# Altium project WLED_Controller.PrjPcb
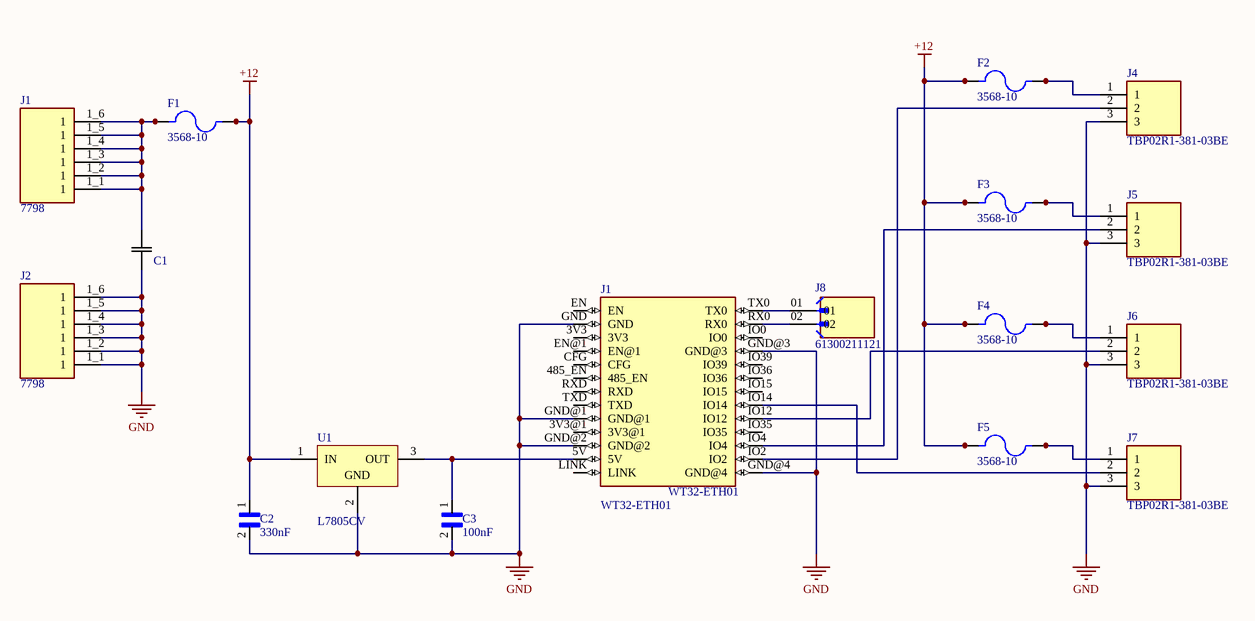
[diagram p0: Sheet1.SchDoc]
1 sheet, 17 parts. Net scope: global (net labels, ports and power ports of the same name join across sheets).
Board file: PCB1.PcbDoc

## Sheet Sheet1.SchDoc
size A4; SheetNumber: 1; SheetTotal: 1

### Parts
(Parts that share a designator on the sheet are numbered #1, #2 ... from top to bottom, then left to right.)
C1  860010675018  [CAP_WCAP-ATG8_10x12.5_WRE]  (value not drawn)
C2  value 330nF  [CAPC2012X145N]  (hidden comment: C2012X7R1H334K125AA)
C3  value 100nF  [CAPC2012X145N]  (hidden comment: C2012X8R1H104K125AA)
F1  3568-10  [FUSE_3568-10]
F2  3568-10  [FUSE_3568-10]
F3  3568-10  [FUSE_3568-10]
F4  3568-10  [FUSE_3568-10]
F5  3568-10  [FUSE_3568-10]
J1#1  7798  [KEYSTONE_7798]
J1#2  WT32-ETH01  [WT32-ETH01]
J2  7798  [KEYSTONE_7798]
J4  TBP02R1-381-03BE  [CUI_TBP02R1-381-03BE]
J5  TBP02R1-381-03BE  [CUI_TBP02R1-381-03BE]
J6  TBP02R1-381-03BE  [CUI_TBP02R1-381-03BE]
J7  TBP02R1-381-03BE  [CUI_TBP02R1-381-03BE]
J8  61300211121  [WURTH_61300211121]
U1  L7805CV  [TO220]

### Nets
+12: C2.1 F1.2 F1.4 F2.1 F2.3 F3.1 F3.3 F4.1 F4.3 F5.1 F5.3 U1.1(IN)
GND: C1.2 C2.2 C3.2 J1#2.GND J1#2.GND@1 J1#2.GND@2 J1#2.GND@3 J1#2.GND@4 J2.1_1(1) J2.1_2(1) J2.1_3(1) J2.1_4(1) J2.1_5(1) J2.1_6(1) J4.3 J5.3 J6.3 J7.3 U1.2(GND)
NetC1_1: C1.1 F1.1 F1.3 J1#1.1_1(1) J1#1.1_2(1) J1#1.1_3(1) J1#1.1_4(1) J1#1.1_5(1) J1#1.1_6(1)
NetC3_1: C3.1 J1#2.5V U1.3(OUT)
NetF2_2: F2.2 F2.4 J4.1
NetF3_2: F3.2 F3.4 J5.1
NetF4_2: F4.2 F4.4 J6.1
NetF5_2: F5.2 F5.4 J7.1
NetJ1#2_IO2: J1#2.IO2 J4.2
NetJ1#2_IO4: J1#2.IO4 J5.2
NetJ1#2_IO12: J1#2.IO12 J6.2
NetJ1#2_IO14: J1#2.IO14 J7.2
NetJ1#2_RX0: J1#2.RX0 J8.02
NetJ1#2_TX0: J1#2.TX0 J8.01

Not connected (* = marked no-connect by the designer): J1#2 3V3 3V3@1 485_EN CFG EN EN@1 IO0 IO15 IO35 IO36 IO39 LINK RXD TXD

### Library data of the parts
C1 = CMP-001-00095-1: No Description Available; Mfr_Name: Wurth Electronics; Type: DEV; Copyright: Copyright (C) 2023 Ultra Librarian. All rights reserved.; RefDes: RefDes; Source: 860010675018.SchLib; Manufacturer_Part_Number: 860010675018; Design Item ID: 860010675018
C2 = CMP-001-00103-1: 0.33 ÂµF Â±10% 50V Ceramic Capacitor X7R 0805 (2012 Metric); MF: TDK; Component Type: Standard; SnapEDA_Link: https://www.snapeda.com/parts/C2012X7R1H334K125AA/TDK/view-part/?ref=snap; Source: C2012X7R1H334K125AA.SchLib; MP: C2012X7R1H334K125AA; Purchase-URL: https://pricing.snapeda.com/search/part/C2012X7R1H334K125AA/?ref=eda; Digi-Key_Part_Number: 445-7541-2-ND; Check_prices: https://www.snapeda.com/parts/C2012X7R1H334K125AA/TDK/view-part/?ref=eda; Design Item ID: C2012X7R1H334K125AA; Case/Package: 2012 TDK; Pins: 2
C3 = CMP-001-00104-1: 0.1 ÂµF Â±10% 50V Ceramic Capacitor X8R 0805 (2012 Metric); MF: TDK; Price: None; Pins: 2; SnapEDA_Link: https://www.snapeda.com/parts/C2012X8R1H104K125AA/TDK/view-part/?ref=snap; Design Item ID: C2012X8R1H104K125AA; Case/Package: 2012 TDK; Check_prices: https://www.snapeda.com/parts/C2012X8R1H104K125AA/TDK/view-part/?ref=eda; Purchase-URL: https://pricing.snapeda.com/search/part/C2012X8R1H104K125AA/?ref=eda; MP: C2012X8R1H104K125AA; Availability: In Stock; Component Type: Standard; Source: C2012X8R1H104K125AA.SchLib
F1-F5 = CMP-005-00016-1: THM-Vertical Entry Mini Auto Blade Fuse Holder, Red; MF: Keystone; Design Item ID: 3568-10; Purchase-URL: https://pricing.snapeda.com/search/part/3568-10/?ref=eda; MP: 3568-10; Price: None; Pins: 4; Value: *; Source: 3568-10.SchLib; Case/Package: None; Availability: In Stock; Component Type: Standard; SnapEDA_Link: https://www.snapeda.com/parts/3568-10/Keystone/view-part/?ref=snap; Check_prices: https://www.snapeda.com/parts/3568-10/Keystone/view-part/?ref=eda
J1#1 J2 = CMP-190-000000-1: Pin Count: 6; Package: None; Availability: Unavailable; Component Type: Standard; MP: 7798; Design Item ID: 7798; Source: 7798.SchLib; Price: None; Value: *
J1#2 = CMP-188-000000-2: MF: wireless-tag; Value: *; Check_prices: https://www.snapeda.com/parts/WT32-ETH01/Wireless-Tag/view-part/?ref=eda; Component Type: Standard; Price: None; MP: WT32-ETH01; Package: None; Source: WT32-ETH01.SchLib; Pin Count: 26; Design Item ID: WT32-ETH01; SnapEDA_Link: https://www.snapeda.com/parts/WT32-ETH01/Wireless-Tag/view-part/?ref=snap; Availability: Not in stock
J4-J7 = CMP-192-000000-1: MF: {'manufacturer': u'CUI'}; Pin Count: 3; Package: None; Value: *; Design Item ID: TBP02R1-381-03BE; Source: TBP02R1-381-03BE.SchLib; MP: TBP02R1-381-03BE; Availability: Unavailable; Price: None; Component Type: Standard
J8 = CMP-002-00083-1: Connector Header Through Hole 2 position 0.100 (2.54mm); MF: Wurth Electronics; Pins: 2; Case/Package: None; Component Type: Standard; Source: 61300211121.SchLib; Design Item ID: 61300211121; SnapEDA_Link: https://www.snapeda.com/parts/61300211121/Wurth+Electronics+Inc./view-part/?ref=snap; MP: 61300211121; Check_prices: https://www.snapeda.com/parts/61300211121/Wurth+Electronics+Inc./view-part/?ref=eda; Value: *
U1 = CMP-019-00018-3: Positive Voltage Regulator IC, 1.5 A, 5 V, 0 to 125 degC, 3-Pin TO-220, RoHS, Tube; Manufacturer: STMicroelectronics; Max Input Voltage: 35V; Min Supply Voltage: 8V; Nominal Output Voltage: 5V; Outputs: 1; Output Current: 1.5A; Dropout Voltage: 2V; Max Supply Voltage: 20V; Min Input Voltage: 7V; Datasheet Version: Rev 30, 09/2012; Min Operating Temperature: 0°C; Manufacturer URL: http://www.st.com/; Pins: 3; Mounting Technology: TH; Output Voltage: 5V; RoHS Compliant: True; Max Ouput Current: 1.5A; Datasheet URL: https://datasheet.ciiva.com/15111/getdatasheetpartid-44136-15111027.pdf; Packaging: Rail/Tube; Max Operating Temperature: 125°C; Case/Package: TO-220; Package Quantity: 50